# EAGLE design Globe V3 (EAGLE 7.5.0)
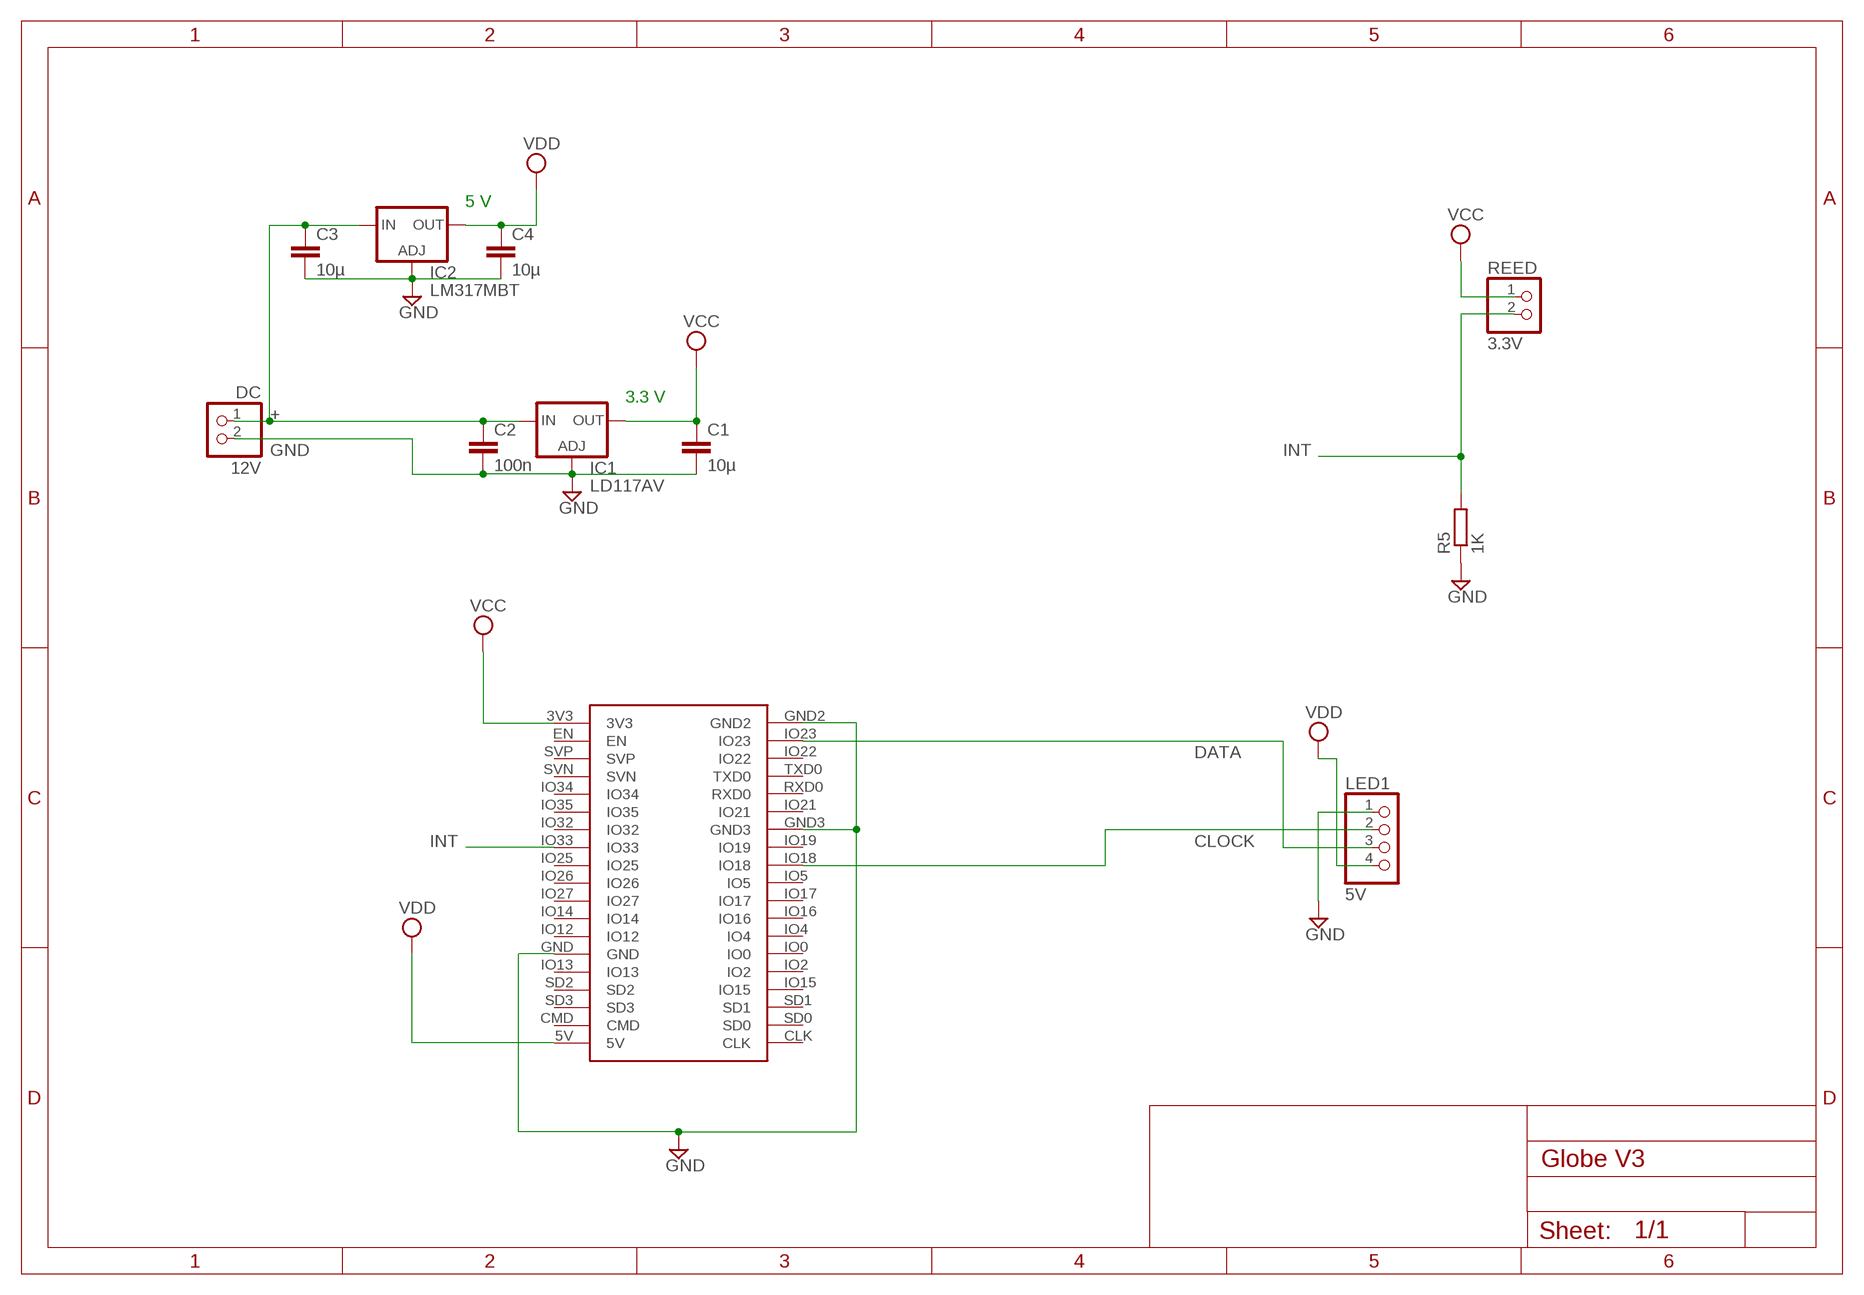
[diagram p0: schematic, sheet 1]

## Parts
C1  10µ  C-EU025-024X044  [C025-024X044]
C2  100n  C-EU050-024X044  [C050-024X044]
C3  10µ  C-EU025-024X044  [C025-024X044]
C4  10µ  C-EU025-024X044  [C025-024X044]
DC  12V  PINHD-1X2  [1X02]
IC1  LD117AV  [TO220L1]
IC2  LM317MBT  [TO220L1]
LED1  5V  PINHD-1X4  [1X04]
R5  1K  R-EU_0207/10  [0207/10]
REED  3.3V  PINHD-1X2  [1X02]
U$1  ESP32_DEVKITC  [ESP32_DEVKITC]

## Nets
+: C2.1 C3.1 DC.1 IC1.3(IN) IC2.3(IN)
CLOCK: LED1.2 U$1.IO18
DATA: LED1.3 U$1.IO23
GND: C1.2 C2.2 C3.2 C4.2 DC.2 IC1.1(ADJ) IC2.1(ADJ) LED1.1 R5.1 U$1.GND U$1.GND2 U$1.GND3
INT: R5.2 REED.2 U$1.IO33
VCC: C1.1 IC1.2(OUT) REED.1 U$1.3V3
VDD: C4.1 IC2.2(OUT) LED1.4 U$1.5V
Unconnected: U$1.CLK U$1.CMD U$1.EN U$1.IO0 U$1.IO2 U$1.IO4 U$1.IO5 U$1.IO12 U$1.IO13 U$1.IO14 U$1.IO15 U$1.IO16 U$1.IO17 U$1.IO19 U$1.IO21 U$1.IO22 U$1.IO25 U$1.IO26 U$1.IO27 U$1.IO32 U$1.IO34 U$1.IO35 U$1.RXD0 U$1.SD0 U$1.SD1 U$1.SD2 U$1.SD3 U$1.SVN U$1.SVP U$1.TXD0

## Notes on the sheet
- 5 V
- 3.3 V

## Library data of the parts
C1-C4 = rcl:C-EU: CAPACITOR, European symbol; SPICEPREFIX: C
DC REED = pinhead:PINHD-1X2: PIN HEADER
IC1 = v-reg:LD117A?*: Low drop fixed and adjustable positive voltage regulators 1 A Source: http://www.st.com/stonline/products/literature/ds/7194/ld1117axx.pdf
IC2 = v-reg:LM317?*: 500 mA Adjustable Output Positive Voltage Regulator Source: http://www.onsemi.co.jp .. LM317M-D.PDF
LED1 = pinhead:PINHD-1X4: PIN HEADER
R5 = rcl:R-EU_: RESISTOR, European symbol; SPICEPREFIX: R
U$1 = esp32_DevKitC:ESP32_DEVKITC

## Board
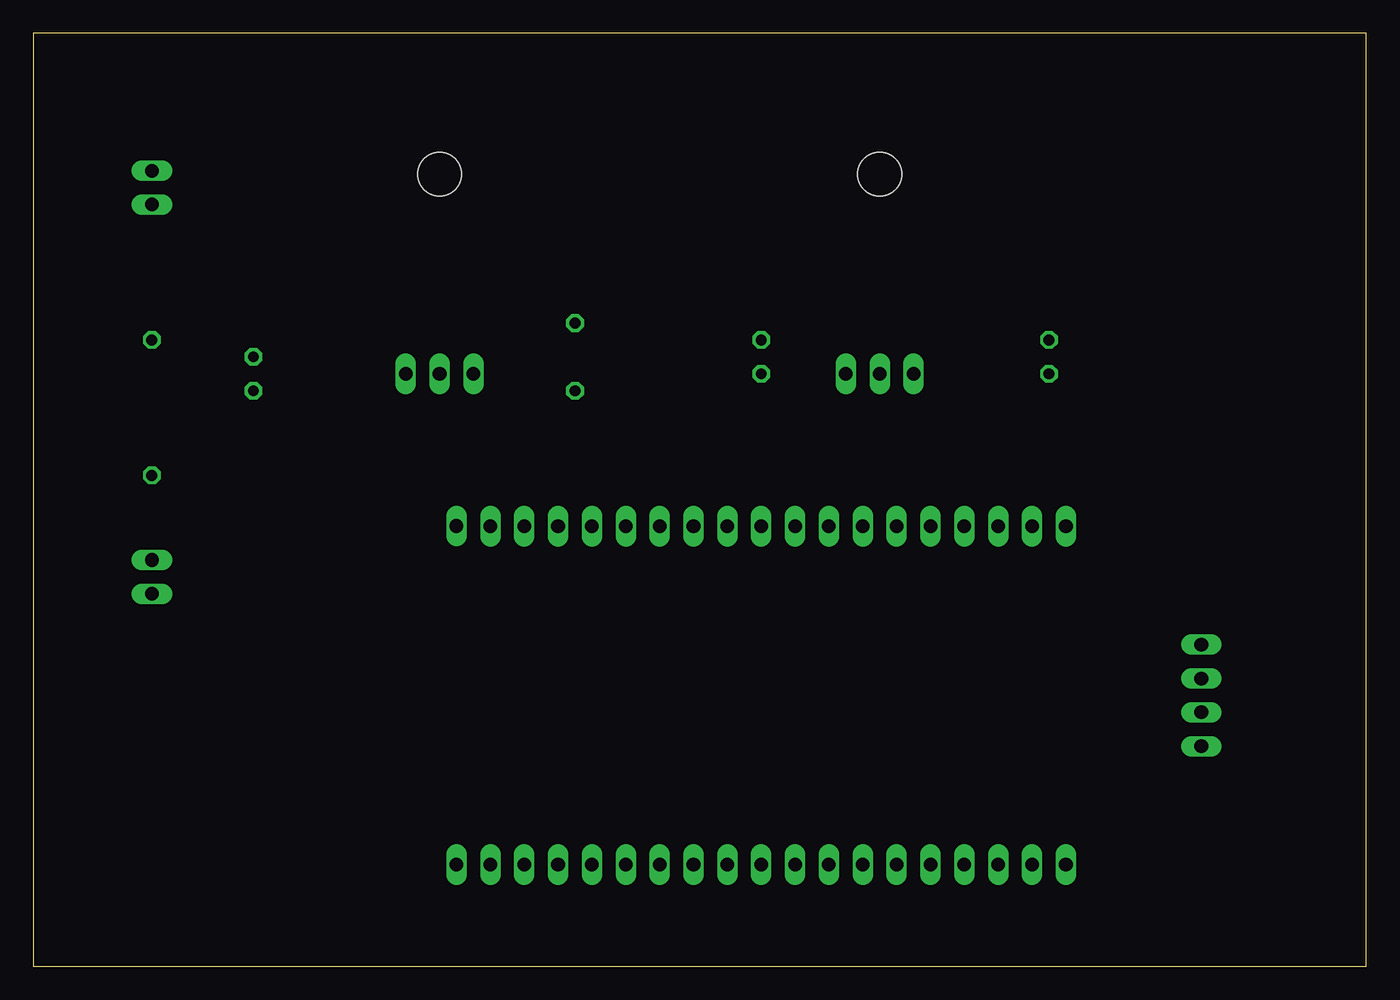
[diagram p1: board, top side]
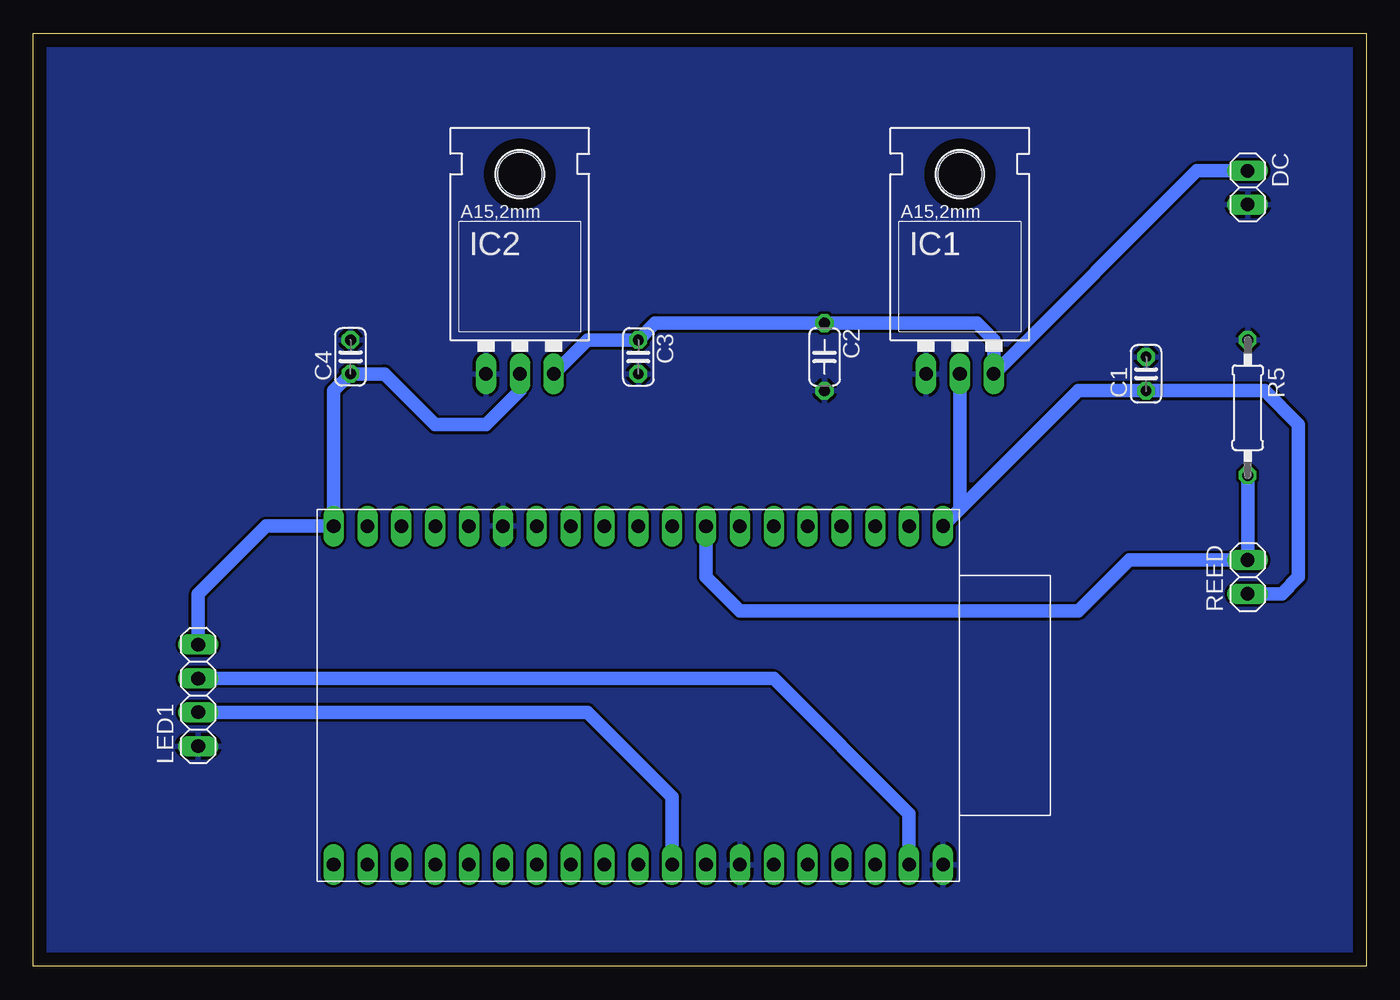
[diagram p2: board, bottom side, seen from below]

Size 100 x 70 mm. Coordinates in mm from the lower left corner, seen from the top.
Outline: 0,0 100,0 100,70 0,70 0,0
Copper layers (1*16): Top 0.035mm / dielectric 1.5mm / Bottom 0.035mm
Design rules "default": minimum track width 10mil, minimum drill 24mil, track to track 8mil, track to pad 8mil, pad to pad 8mil, via to via 8mil, smd to smd 8mil, copper to edge 40mil, drill to drill 8mil, minimum pad ring 10mil, minimum via ring 8mil, stop-mask expansion 4mil, vias tented up to drill 0mil, thermal gap 10mil

### Footprints (pad centres in the part's own frame; a part is rotated, then mirrored left to right if it is on the bottom)
C025-024X044 = drill 0.813 octagon: 1 -1.27,0; 2 1.27,0
C050-024X044 = drill 0.813 octagon: 1 -2.54,0; 2 2.54,0
1X02 = drill 1.016 long: 1 -1.27,0; 2 1.27,0
TO220L1 = drill 1.016 long: 1 -2.54,-3.81; 2 0,-3.81; 3 2.54,-3.81 | hole 3.302: 0,11.176
1X04 = drill 1.016 long: 1 -3.81,0; 2 -1.27,0; 3 1.27,0; 4 3.81,0
0207/10 = drill 0.813 octagon: 1 -5.08,0; 2 5.08,0
ESP32_DEVKITC = drill 1.016 long: 3V3 -22.86,-12.71; 5V 22.86,-12.7; CLK 22.86,12.7; CMD 20.32,-12.7; EN -20.32,-12.7; GND 10.16,-12.7; GND2 -22.86,12.7; GND3 -7.62,12.7; IO0 10.16,12.7; IO2 12.7,12.7; IO4 7.62,12.7; IO5 0,12.7; IO12 7.62,-12.7; IO13 12.7,-12.7; IO14 5.08,-12.7; IO15 15.24,12.7; IO16 5.08,12.7; IO17 2.54,12.7; IO18 -2.54,12.7; IO19 -5.08,12.7; IO21 -10.16,12.7; IO22 -17.78,12.7; IO23 -20.32,12.7; IO25 -2.54,-12.7; IO26 0,-12.7; IO27 2.54,-12.7; IO32 -7.62,-12.7; IO33 -5.08,-12.7; IO34 -12.7,-12.7; IO35 -10.16,-12.7; RXD0 -12.7,12.7; SD0 20.32,12.7; SD1 17.78,12.7; SD2 15.24,-12.7; SD3 17.78,-12.7; SVN -15.24,-12.7; SVP -17.78,-12.7; TXD0 -15.24,12.7

### Placement (x,y rotation side)
C1  16.51,44.45 90 bottom
C2  40.64,45.72 270 bottom
C3  54.61,45.72 270 bottom
C4  76.2,45.72 90 bottom
DC  8.89,58.42 270 bottom
IC1  30.48,48.26 0 bottom
IC2  63.5,48.26 0 bottom
LED1  87.63,20.32 90 bottom
R5  8.89,41.91 270 bottom
REED  8.89,29.21 90 bottom
U$1  54.61,20.32 180 bottom

### Tracks (layer width: path | path; a pad name or v marks a point on that pad's centre or on a via)
+
  Bottom 1.016: DC.1 12.7,59.69 IC1.3 27.94,46.99 29.21,48.26 C2.1 53.34,48.26 C3.1 58.42,46.99 IC2.3
CLOCK
  Bottom 1.016: U$1.IO18 52.07,12.7 58.42,19.05 LED1.2
DATA
  Bottom 1.016: U$1.IO23 34.29,11.43 44.45,21.59 LED1.3
GND
  pour Bottom: 0,69.85 100.33,69.85 100.33,0 0,0
INT
  Bottom 1.016: R5.2 REED.2 17.78,30.48 21.59,26.67 46.99,26.67 49.53,29.21 U$1.IO33
VCC
  Bottom 1.016: IC1.2 30.48,34.3 U$1.3V3 21.6,43.18 C1.1 7.62,43.18 5.08,40.64 5.08,29.21 6.35,27.94 REED.1
VDD
  Bottom 1.016: LED1.4 87.63,27.94 82.55,33.02 U$1.5V 77.47,43.18 C4.1 73.66,44.45 69.85,40.64 66.04,40.64 63.5,43.18 IC2.2